# EAGLE schematic board2 (EAGLE 9.6.2)
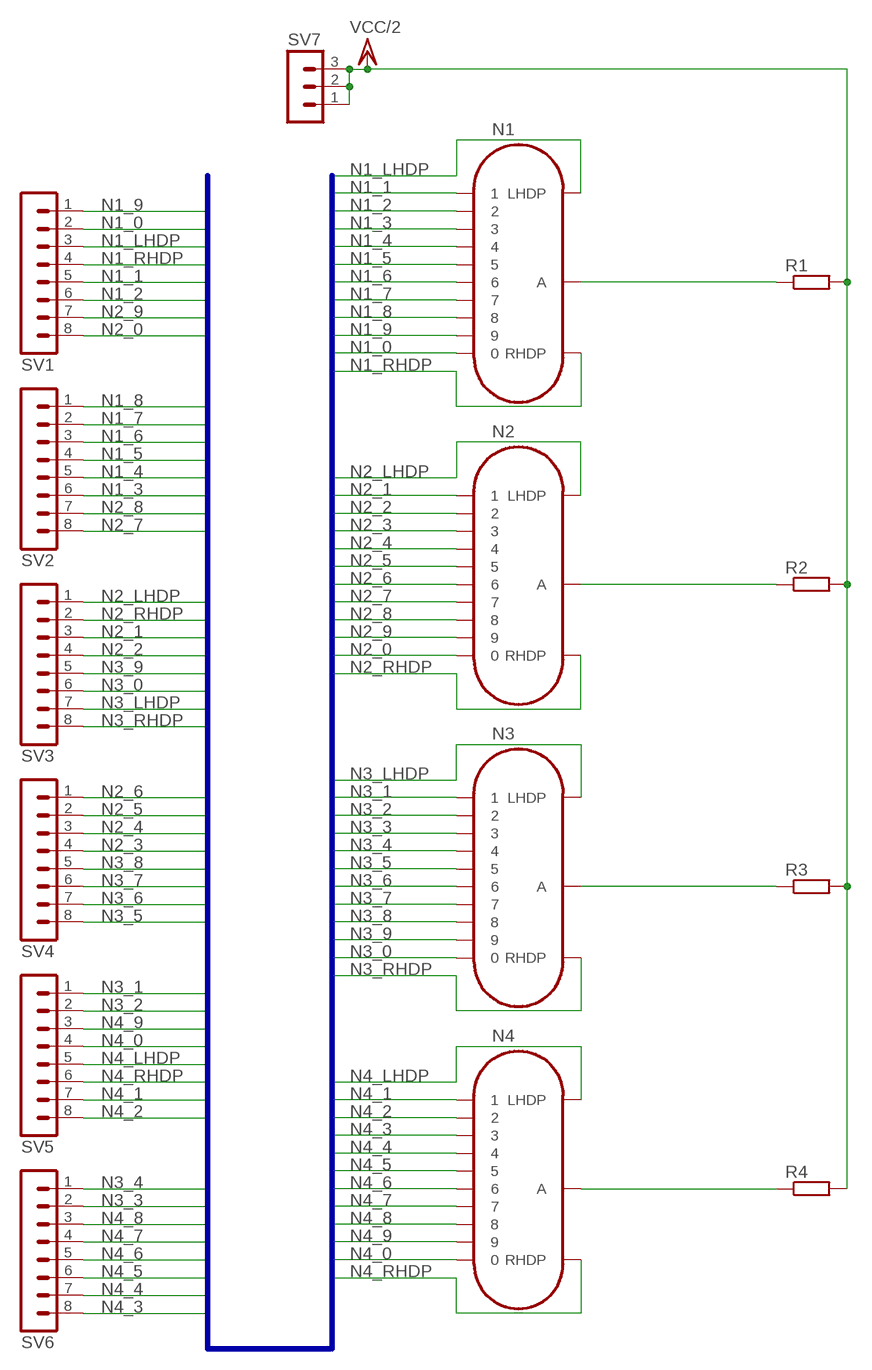
[diagram p0: schematic, sheet 1]

## Parts
N1  IN-14  [IN-14]
N2  IN-14  [IN-14]
N3  IN-14  [IN-14]
N4  IN-14  [IN-14]
R1  R-EU_0207/7  [0207/7]
R2  R-EU_0207/7  [0207/7]
R3  R-EU_0207/7  [0207/7]
R4  R-EU_0207/7  [0207/7]
SV1  MA08-1  [MA08-1]
SV2  MA08-1  [MA08-1]
SV3  MA08-1  [MA08-1]
SV4  MA08-1  [MA08-1]
SV5  MA08-1  [MA08-1]
SV6  MA08-1  [MA08-1]
SV7  MA03-1  [MA03-1]

## Nets
N1_0: N1.0 SV1.2
N1_1: N1.1 SV1.5
N1_2: N1.2 SV1.6
N1_3: N1.3 SV2.6
N1_4: N1.4 SV2.5
N1_5: N1.5 SV2.4
N1_6: N1.6 SV2.3
N1_7: N1.7 SV2.2
N1_8: N1.8 SV2.1
N1_9: N1.9 SV1.1
N1_LHDP: N1.LHDP SV1.3
N1_RHDP: N1.RHDP SV1.4
N2_0: N2.0 SV1.8
N2_1: N2.1 SV3.3
N2_2: N2.2 SV3.4
N2_3: N2.3 SV4.4
N2_4: N2.4 SV4.3
N2_5: N2.5 SV4.2
N2_6: N2.6 SV4.1
N2_7: N2.7 SV2.8
N2_8: N2.8 SV2.7
N2_9: N2.9 SV1.7
N2_LHDP: N2.LHDP SV3.1
N2_RHDP: N2.RHDP SV3.2
N3_0: N3.0 SV3.6
N3_1: N3.1 SV5.1
N3_2: N3.2 SV5.2
N3_3: N3.3 SV6.2
N3_4: N3.4 SV6.1
N3_5: N3.5 SV4.8
N3_6: N3.6 SV4.7
N3_7: N3.7 SV4.6
N3_8: N3.8 SV4.5
N3_9: N3.9 SV3.5
N3_LHDP: N3.LHDP SV3.7
N3_RHDP: N3.RHDP SV3.8
N4_0: N4.0 SV5.4
N4_1: N4.1 SV5.7
N4_2: N4.2 SV5.8
N4_3: N4.3 SV6.8
N4_4: N4.4 SV6.7
N4_5: N4.5 SV6.6
N4_6: N4.6 SV6.5
N4_7: N4.7 SV6.4
N4_8: N4.8 SV6.3
N4_9: N4.9 SV5.3
N4_LHDP: N4.LHDP SV5.5
N4_RHDP: N4.RHDP SV5.6
N$1: N1.A R1.1
N$2: N2.A R2.1
N$3: N3.A R3.1
N$4: N4.A R4.1
VCC/2: R1.2 R2.2 R3.2 R4.2 SV7.1 SV7.2 SV7.3

## Buses
N1_0,N1_1,N1_2,N1_3,N1_4,N1_5,N1_6,N1_7,N1_8,N1_9,N1_LHDP,N1_RHDP,N2_0,N2_1,N2_2,N2_3,N2_4,N2_5,N2_6,N2_7,N2_8,N2_9,N2_LHDP,N2_RHDP,N3_0,N3_1,N3_2,N3_3,N3_4,N3_5,N3_6,N3_7,N3_8,N3_9,N3_LHDP,N3_RHDP,N4_0,N4_1,N4_2,N4_3,N4_4,N4_5,N4_6,N4_7,N4_8,N4_9,N4_LHDP,N4_RHDP

## Library data of the parts
N1-N4 = russian-nixies:IN-14: IN-14: medium numeric frontview nixie tube
R1-R4 = resistor:R-EU_: RESISTOR, European symbol
SV1-SV6 = con-lstb-mod:MA08-1: PIN HEADER; OC_FARNELL: unknown; OC_NEWARK: unknown
SV7 = con-lstb:MA03-1: PIN HEADER; OC_FARNELL: unknown; OC_NEWARK: unknown